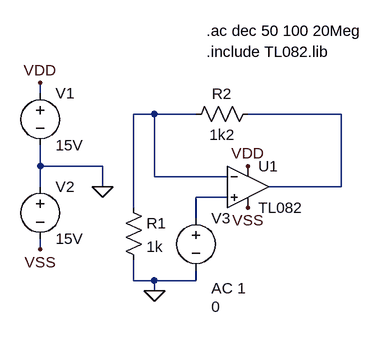
[diagram p0: schematic przyklad_opamp.asc]
przyklad_opamp.asc, the LTspice schematic file:
Version 4
SHEET 1 880 680
WIRE -224 32 -224 16
WIRE -48 64 -80 64
WIRE 16 64 -48 64
WIRE 240 64 96 64
WIRE -224 144 -224 112
WIRE -128 144 -224 144
WIRE -48 160 -48 64
WIRE 64 160 -48 160
WIRE -224 176 -224 144
WIRE -128 176 -128 144
WIRE 240 176 240 64
WIRE 240 176 128 176
WIRE 64 192 16 192
WIRE -80 208 -80 64
WIRE 16 224 16 192
WIRE -224 272 -224 256
WIRE -80 320 -80 288
WIRE -48 320 -80 320
WIRE 16 320 16 304
WIRE 16 320 -48 320
WIRE -48 336 -48 320
FLAG -128 176 0
FLAG -224 16 VDD
FLAG -224 272 VSS
FLAG 96 144 VDD
FLAG 96 208 VSS
FLAG -48 336 0
SYMBOL Opamps\\opamp2 96 112 R0
SYMATTR InstName U1
SYMATTR Value TL082
SYMATTR SpiceModel TL082
SYMBOL voltage -224 16 R0
SYMATTR InstName V1
SYMATTR Value 15V
SYMBOL voltage -224 160 R0
SYMATTR InstName V2
SYMATTR Value 15V
SYMBOL res -96 192 R0
SYMATTR InstName R1
SYMATTR Value 1k
SYMBOL res 112 48 R90
WINDOW 0 0 56 VBottom 2
WINDOW 3 32 56 VTop 2
SYMATTR InstName R2
SYMATTR Value 1k2
SYMBOL voltage 16 208 R0
WINDOW 3 24 152 Left 2
WINDOW 123 24 124 Left 2
WINDOW 39 0 0 Left 2
SYMATTR Value 0
SYMATTR Value2 AC 1
SYMATTR InstName V3
TEXT 32 -64 Left 2 !.ac dec 50 100 20Meg
TEXT 32 -32 Left 2 !.include TL082.lib

The netlist it stands for:
* przyklad_opamp.asc
XU1 N003 N001 VDD VSS N002 TL082 TL082  ; pins In+ In- V+ V- OUT
V1 VDD 0 15V
V2 0 VSS 15V
R1 N001 0 1k
R2 N002 N001 1k2
V3 N003 0 0 AC 1
.ac dec 50 100 20Meg
.include TL082.lib
.backanno
.end